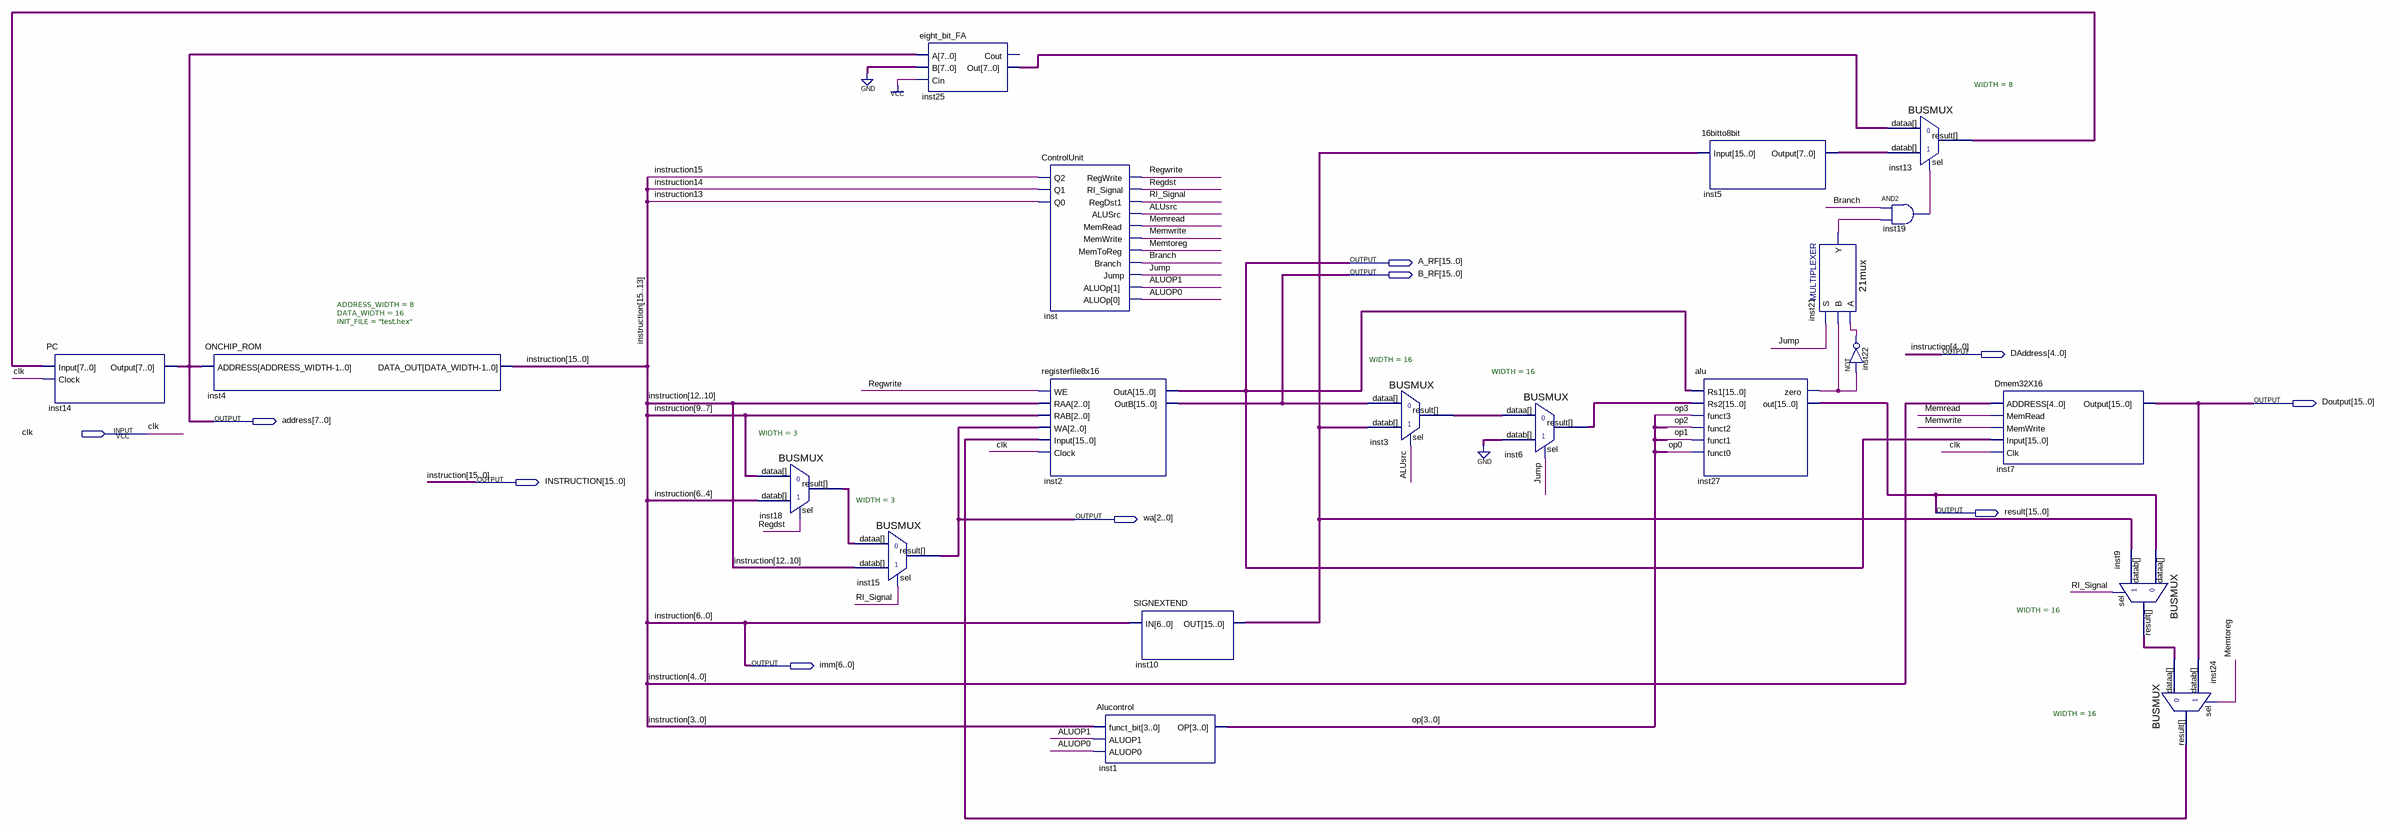
[diagram p0: schematic sheet]
// Quartus schematic project.bdf as structural Verilog: 20 symbols, 10 pins
module project (
  input  clk,
  output [15:0] A_RF,
  output [15:0] B_RF,
  output [4:0] DAddress,
  output [15:0] Doutput,
  output [7:0] address,
  output [15:0] INSTRUCTION,
  output [15:0] result,
  output [2:0] wa,
  output [6:0] imm
);

  wire ALUOP0, ALUOP1, ALUsrc, Branch, inst19_out, inst21_y, inst22_out, inst27_zero, Jump, Memread,
       Memtoreg, Memwrite, Regdst, Regwrite, RI_Signal;
  wire [2:0] inst18_result;
  wire [3:0] op;
  wire [7:0] inst5_output, inst13_result, inst25_out;
  wire [15:0] inst3_result, inst6_result, inst9_result, inst10_out, inst24_result;

  PC inst14 (.Input(inst13_result), .Clock(clk), .Output(address));
  ONCHIP_ROM #(.ADDRESS_WIDTH(8), .DATA_WIDTH(16), .INIT_FILE("test.hex")) inst4 (
    .ADDRESS(address), .DATA_OUT({INSTRUCTION[15:7], imm[6:5], DAddress}));
  BUSMUX #(.WIDTH(3)) inst18 (
    .datab({imm[6:5], DAddress[4]}), .sel(Regdst), .dataa(INSTRUCTION[9:7]), .result(inst18_result));
  BUSMUX #(.WIDTH(3)) inst15 (.datab(INSTRUCTION[12:10]), .sel(RI_Signal), .dataa(inst18_result), .result(wa));
  eight_bit_FA inst25 (.A(address), .B({8{1'b0}}), .Cin(1'b1), .Out(inst25_out));  // open: Cout
  ControlUnit inst (
    .Q2(INSTRUCTION[15]), .Q1(INSTRUCTION[14]), .Q0(INSTRUCTION[13]), .RegWrite(Regwrite),
    .RI_Signal(Regdst), .RegDst1(RI_Signal), .ALUSrc(ALUsrc), .MemRead(Memread), .MemWrite(Memwrite),
    .MemToReg(Memtoreg), .Branch(Branch), .Jump(Jump), .ALUOp({ALUOP1, ALUOP0}));
  registerfile8x16 inst2 (
    .WE(Regwrite), .RAA(INSTRUCTION[12:10]), .RAB(INSTRUCTION[9:7]), .WA(wa), .Input(inst24_result),
    .Clock(clk), .OutA(A_RF), .OutB(B_RF));
  Alucontrol inst1 (.funct_bit(DAddress[3:0]), .ALUOP1(ALUOP1), .ALUOP0(ALUOP0), .OP(op));
  SIGNEXTEND inst10 (.IN({imm[6:5], DAddress}), .OUT(inst10_out));
  BUSMUX #(.WIDTH(16)) inst3 (.datab(inst10_out), .sel(ALUsrc), .dataa(B_RF), .result(inst3_result));
  BUSMUX #(.WIDTH(16)) inst6 (.datab({16{1'b0}}), .sel(Jump), .dataa(inst3_result), .result(inst6_result));
  alu inst27 (
    .Rs1(A_RF), .Rs2(inst6_result), .funct3(op[3]), .funct2(op[2]), .funct1(op[1]), .funct0(op[0]),
    .zero(inst27_zero), .out(result));
  \16bitto8bit  inst5 (.Input(inst10_out), .Output(inst5_output));
  \21mux  inst21 (.S(Jump), .B(inst27_zero), .A(inst22_out), .Y(inst21_y));
  BUSMUX #(.WIDTH(8)) inst13 (.datab(inst5_output), .sel(inst19_out), .dataa(inst25_out), .result(inst13_result));
  and inst19 (inst19_out, Branch, inst21_y);
  not inst22 (inst22_out, inst27_zero);
  Dmem32X16 inst7 (
    .ADDRESS(DAddress), .MemRead(Memread), .MemWrite(Memwrite), .Input(A_RF), .Clk(clk), .Output(Doutput));
  BUSMUX #(.WIDTH(16)) inst9 (.datab(inst10_out), .sel(RI_Signal), .dataa(result), .result(inst9_result));
  BUSMUX #(.WIDTH(16)) inst24 (.datab(Doutput), .sel(Memtoreg), .dataa(inst9_result), .result(inst24_result));

  assign imm[4:0] = DAddress;
  assign INSTRUCTION[6:0] = {imm[6:5], DAddress};
endmodule
